# Altium schematic sheet analog.SchDoc: Small Impedance Meter (Analogue Part)
size A4; ApprovedBy: Matej Gomboc; CheckedBy: Matej Gomboc; Author: Matej Gomboc; DrawnBy: Matej Gomboc; Engineer: Matej Gomboc; DocumentNumber: 2; Revision: 1.0; SheetNumber: 2; SheetTotal: 3; DocumentName: Analogue Part; ProjectName: Small Impedance Meter
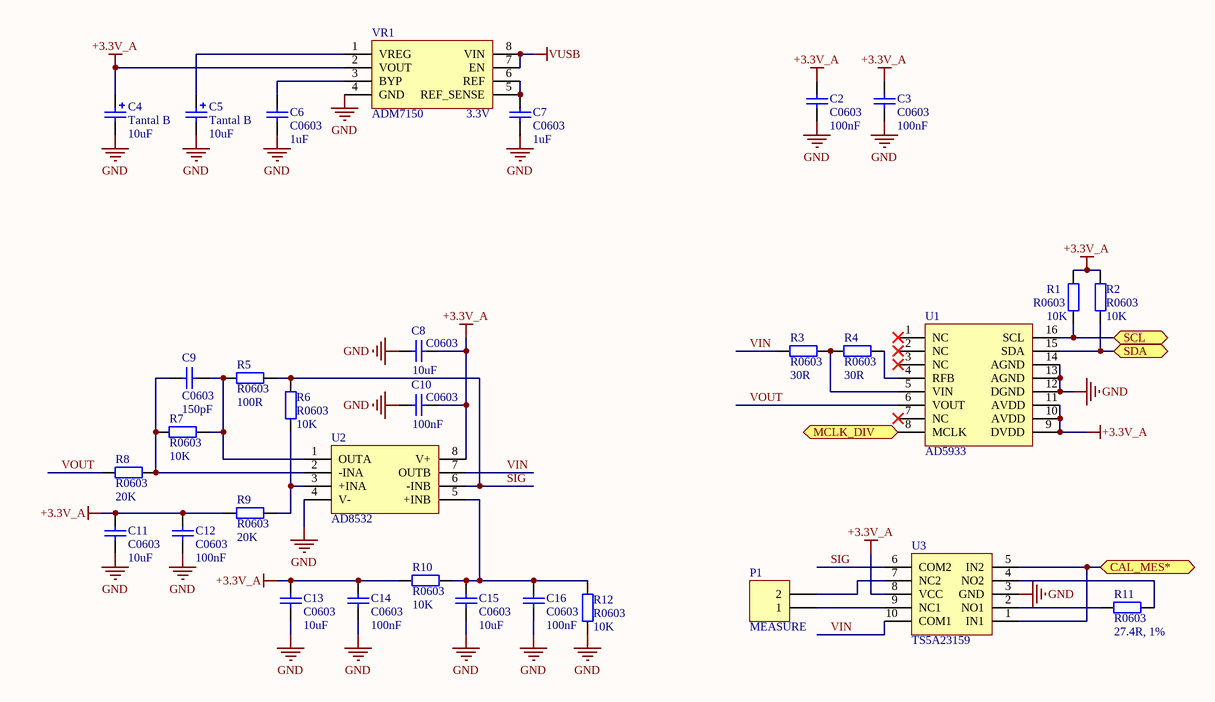
[diagram p0: analog.SchDoc]

## Parts
C2  C0603  value 100nF  [0603_HandSoldering]
C3  C0603  value 100nF  [0603_HandSoldering]
C4  Tantal B  value 10uF  [AVX-CAPC3528_V]
C5  Tantal B  value 10uF  [AVX-CAPC3528_V]
C6  C0603  value 1uF  [0603_HandSoldering]
C7  C0603  value 1uF  [0603_HandSoldering]
C8  C0603  value 10uF  [0603_HandSoldering]
C9  C0603  value 150pF  [0603_HandSoldering]
C10  C0603  value 100nF  [0603_HandSoldering]
C11  C0603  value 10uF  [0603_HandSoldering]
C12  C0603  value 100nF  [0603_HandSoldering]
C13  C0603  value 10uF  [0603_HandSoldering]
C14  C0603  value 100nF  [0603_HandSoldering]
C15  C0603  value 10uF  [0603_HandSoldering]
C16  C0603  value 100nF  [0603_HandSoldering]
P1  MEASURE  [HDR1X2]
R1  R0603  value 10K  [0603_HandSoldering]
R2  R0603  value 10K  [0603_HandSoldering]
R3  R0603  value 30R  [0603_HandSoldering]
R4  R0603  value 30R  [0603_HandSoldering]
R5  R0603  value 100R  [0603_HandSoldering]
R6  R0603  value 10K  [0603_HandSoldering]
R7  R0603  value 10K  [0603_HandSoldering]
R8  R0603  value 20K  [0603_HandSoldering]
R9  R0603  value 20K  [0603_HandSoldering]
R10  R0603  value 10K  [0603_HandSoldering]
R11  R0603  value 27.4R, 1%  [0603_HandSoldering]
R12  R0603  value 10K  [0603_HandSoldering]
U1  AD5933  [AD5933]
U2  AD8532  [AD8532_MSOP8]
U3  TS5A23159  [TS5A23159_VSSOP10]
VR1  ADM7150  value 3.3V  [ADM7150_SOIC8]

## Ports
CAL_MES*, MCLK_DIV, SCL, SDA

## Nets
+3.3V_A: C2.1 C3.1 C4.1 C8.1 C10.1 C11.2 C12.2 C13.2 C14.2 R1.2 R2.2 R9.2 R10.2 U1.9(DVDD) U1.10(AVDD) U1.11(AVDD) U2.8(V+) U3.8(VCC) VR1.2(VOUT)
GND: C2.2 C3.2 C4.2 C5.2 C6.1 C7.1 C8.2 C10.2 C11.1 C12.1 C13.1 C14.1 C15.1 C16.1 R12.1 U1.12(DGND) U1.13(AGND) U1.14(AGND) U2.4(V-) U3.3(GND) VR1.4(GND)
VUSB: VR1.7(EN) VR1.8(VIN)
CAL_MES*: U3.1(IN1) U3.5(IN2) ; port CAL_MES*
MCLK_DIV: U1.8(MCLK) ; port MCLK_DIV
SCL: R1.1 U1.16(SCL) ; port SCL
SDA: R2.1 U1.15(SDA) ; port SDA
SIG: R5.2 R6.2 U2.6(-INB) U3.6(COM2)
VIN: R3.2 U2.7(OUTB) U3.10(COM1)
VOUT: R8.1 U1.6(VOUT)
NetC5_1: C5.1 VR1.1(VREG)
NetC6_2: C6.2 VR1.3(BYP)
NetC7_2: C7.2 VR1.5(REF_SENSE) VR1.6(REF)
NetC9_1: C9.1 R7.1 R8.2 U2.2(-INA)
NetC9_2: C9.2 R5.1 R7.2 U2.1(OUTA)
NetC15_2: C15.2 C16.2 R10.1 R12.2 U2.5(+INB)
NetP1_1: P1.1 U3.9(NC1)
NetP1_2: P1.2 U3.7(NC2)
NetR3_1: R3.1 R4.2 U1.5(VIN)
NetR4_1: R4.1 U1.4(RFB)
NetR6_1: R6.1 R9.1 U2.3(+INA)
NetR11_1: R11.1 U3.2(NO1)
NetR11_2: R11.2 U3.4(NO2)

Not connected (* = marked no-connect by the designer): U1 1(NC)* 2(NC)* 3(NC)* 7(NC)*

## Library data of the parts
C2 C3 C6-C16 = Capacitor: Ceramic Capacitor
C4 C5 = Capacitor Tantalum: Tantalum Capacitor
P1 = Header 2: Header, 2-Pin
R1-R12 = Resistor
U1 = AD5933: Network Analyzer
U2 = AD8532: High Current Output OpAmp
U3 = TS5A23159: 2-Channel SPDT Switch
VR1 = ADM7150: 800 mA Ultralow Noise,  High PSRR, RF Linear Regulator